# Altium project de10ext.PrjPcb
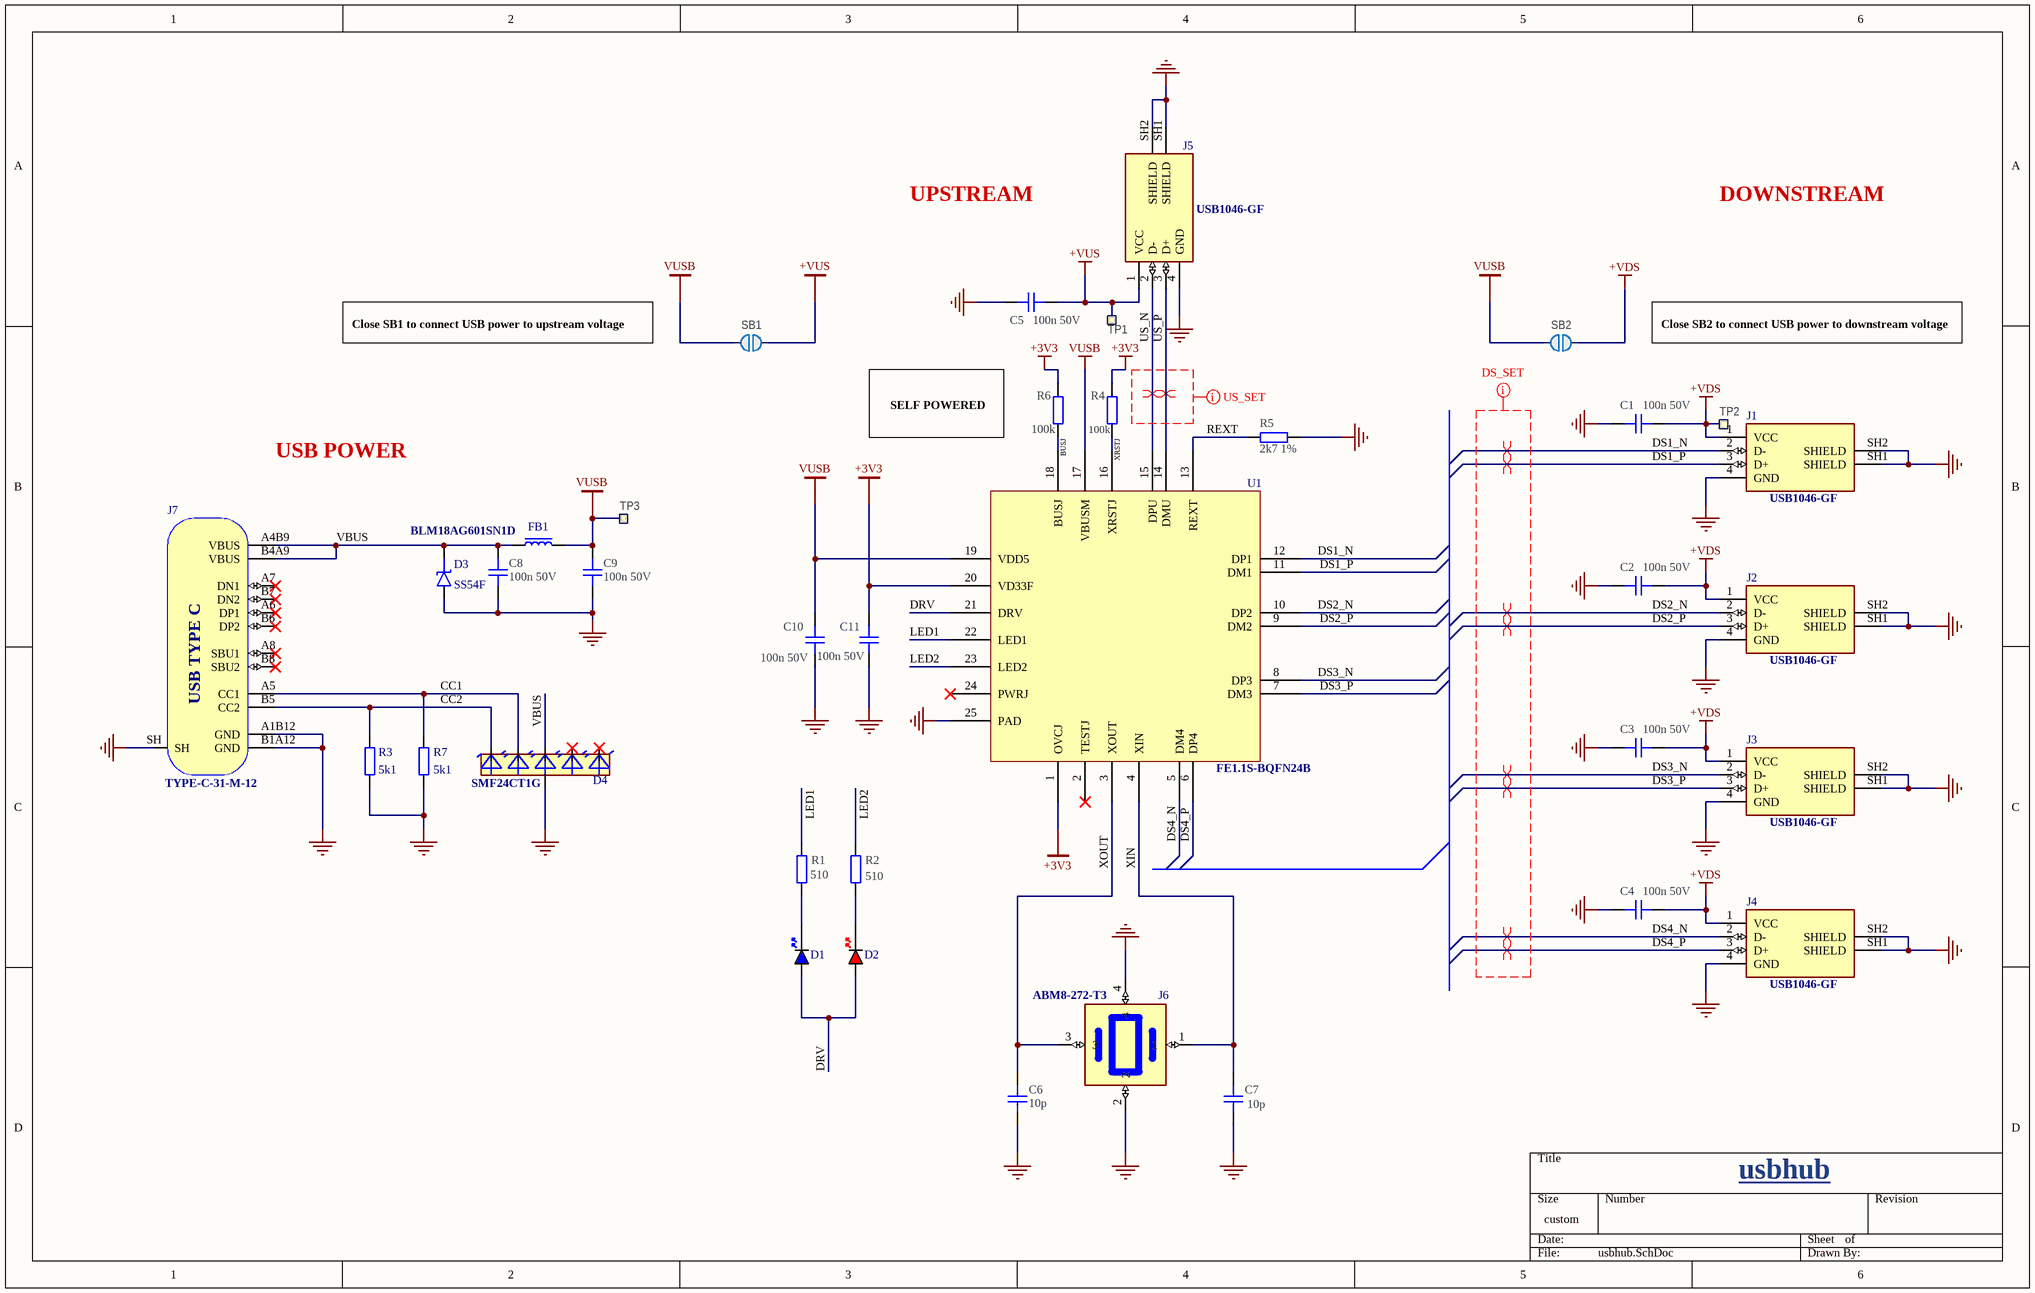
[diagram p0: usbhub.SchDoc]
2 sheets, 81 parts. Net scope: global (net labels, ports and power ports of the same name join across sheets).
Board file: de10ext.PcbDoc
Sheets:
  usbhub.SchDoc
  vga&audio.SchDoc

## Sheet usbhub.SchDoc
size 381 x 241 mm; SheetNumber: 1; SheetTotal: 2

### Parts
C1  100n 50V  [CAPC1005X04L]
C2  100n 50V  [CAPC1005X04L]
C3  100n 50V  [CAPC1005X04L]
C4  100n 50V  [CAPC1005X04L]
C5  100n 50V  [CAPC1005X04L]
C6  10p  [CAPC1005X04L]
C7  10p  [CAPC1005X04L]
C8  100n 50V  [CAPC1005X04L]
C9  100n 50V  [CAPC1005X04L]
C10  100n 50V  [CAPC1005X04L]
C11  100n 50V  [CAPC1005X04L]
D1  BLUE  [LED_0402_BLUE]  (value not drawn)
D2  RED  [LED_0402_RED]  (value not drawn)
D3  SS54F  [DIOM5226X100N]
D4  SMF24CT1G  [SOT65P210X110-6N]
FB1  BLM18AG601SN1D  [FB_0603]
J1  USB1046-GF  [GCT_USB1046-GF-0190-L-B-A_REVB4]
J2  USB1046-GF  [GCT_USB1046-GF-0190-L-B-A_REVB4]
J3  USB1046-GF  [GCT_USB1046-GF-0190-L-B-A_REVB4]
J4  USB1046-GF  [GCT_USB1046-GF-0190-L-B-A_REVB4]
J5  USB1046-GF  [GCT_USB1046-GF-0190-L-B-A_REVB4]
J6  ABM8-272-T3  [ABM8-272-T3]
J7  TYPE-C-31-M-12  [TYPE-C-31-M-12]
R1  510  [RESC1005X04L]
R2  510  [RESC1005X04L]
R3  5k1  [RES_0603]
R4  100k  [RESC1005X04L]
R5  2k7 1%  [RESC1005X04L]
R6  100k  [RESC1005X04L]
R7  5k1  [RES_0603]
SB1  Solderbridge  [Solderbridge]  (value not drawn)  (no BOM)
SB2  Solderbridge  [Solderbridge]  (value not drawn)  (no BOM)
TP1  Ø1.0mm,SMD  [TP_SMD_D1.0mm]  (value not drawn)  (no BOM)
TP2  Ø1.0mm,SMD  [TP_SMD_D1.0mm]  (value not drawn)  (no BOM)
TP3  Ø1.0mm,SMD  [TP_SMD_D1.0mm]  (value not drawn)  (no BOM)
U1  FE1.1S-BQFN24B  [QFN50P400X400X80-25N]

### Nets
+3V3: C11.2 R4.2 R6.2 U1.1(OVCJ) U1.20(VD33F)
+VDS: C1.2 C2.2 C3.2 C4.2 J1.1(VCC) J2.1(VCC) J3.1(VCC) J4.1(VCC) SB2.1 TP2.1
+VUS: C5.2 J5.1(VCC) SB1.1 TP1.1
GND: C1.1 C2.1 C3.1 C4.1 C5.1 C6.1 C7.1 C8.2 C9.2 C10.1 C11.1 D3.A D4.2(A) J1.4(GND) J1.SH1(SHIELD) J1.SH2(SHIELD) J2.4(GND) J2.SH1(SHIELD) J2.SH2(SHIELD) J3.4(GND) J3.SH1(SHIELD) J3.SH2(SHIELD) J4.4(GND) J4.SH1(SHIELD) J4.SH2(SHIELD) J5.4(GND) J5.SH1(SHIELD) J5.SH2(SHIELD) J6.2 J6.4 J7.A1B12(GND) J7.B1A12(GND) J7.SH R3.1 R5.2 R7.1 U1.25(PAD)
VUSB: C9.1 C10.2 FB1.1 SB1.2 SB2.2 TP3.1 U1.17(VBUSM) U1.19(VDD5)
BUSJ: R6.1 U1.18(BUSJ)
CC1: D4.3(C2) J7.A5(CC1) R7.2
CC2: D4.1(C1) J7.B5(CC2) R3.2
DRV: D1.A D2.A U1.21(DRV)
DS1_N: J1.2(D-) U1.12(DP1)
DS1_P: J1.3(D+) U1.11(DM1)
DS2_N: J2.2(D-) U1.10(DP2)
DS2_P: J2.3(D+) U1.9(DM2)
DS3_N: J3.2(D-) U1.8(DP3)
DS3_P: J3.3(D+) U1.7(DM3)
DS4_N: J4.2(D-) U1.5(DM4)
DS4_P: J4.3(D+) U1.6(DP4)
LED1: R1.2 U1.22(LED1)
LED2: R2.2 U1.23(LED2)
REXT: R5.1 U1.13(REXT)
US_N: J5.2(D-) U1.15(DPU)
US_P: J5.3(D+) U1.14(DMU)
VBUS: C8.1 D3.K D4.4(C3) FB1.2 J7.A4B9(VBUS) J7.B4A9(VBUS)
XIN: C7.2 J6.1 U1.4(XIN)
XOUT: C6.2 J6.3 U1.3(XOUT)
XRSTJ: R4.1 U1.16(XRSTJ)
NetD1_K: D1.K R1.1
NetD2_K: D2.K R2.1

Not connected (* = marked no-connect by the designer): D4 5(C4)* 6(C5)*; J7 A6(DP1)* A7(DN1)* A8(SBU1)* B6(DP2)* B7(DN2)* B8(SBU2)*; U1 2(TESTJ)* 24(PWRJ)*

### Layout directives
mark named DS_SET: (no net found under the mark)
differential pair: DS1_N, DS1_P, DS2_N, DS2_P, DS3_N, DS3_P, DS4_N, DS4_P, US_N, US_P
mark named US_SET: (no net found under the mark)

### Notes on the sheet
- UPSTREAM
- DOWNSTREAM
- Close SB1 to connect USB power to upstream voltage
- Close SB2 to connect USB power to downstream voltage
- SELF POWERED
- USB POWER
- usbhub
- (in symbol TYPE-C-31-M-12) USB TYPE C

### Library data of the parts
C1-C11 = C0402-4µ7: Capacitor, X5R, ±20%; Manufacturer: N.A.; Part number IPS: 00000001251, 00000007165; Part number NEMS: 100200193; Value: 4.7µF; Note: 10V; Artikkelnr Noca: 20039482; Pad Count: 2; Component Status: Active; Part Number: C0402-4µ7; Manufacturer Part Number: N.A.; ComponentLink1URL: N.A.; ComponentLink1Description: Datasheet; ComponentLink2URL: N.A.; ComponentLink2Description: Supplier link; HelpURL: N.A.; Footprint Doc: 0402; LatestRevisionDate: 2017-11-09; Published: 2009-05-08; Supplier 1: Digi-Key; Supplier Part Number 1: 490-13252-1-ND; Supplier 2: N.A.; Supplier Part Number 2: N.A.; PartId: 100200193; Component Class: Capacitors; Author: rsk; Part number Norautron: N.A.
D1 = LED_0402_BLUE: LED 0402 BLUE SMD
D2 = LED_0402_RED: LED 0402 RED SMD
D3 = Schottky Diode_3: Schottky Diode SMD SMAF package
D4 = SMF24CT1G: Quint Uni-Directional TVS Diode, 100W, 6-Pin SC-88 | ON Semiconductor SMF24CT1G; MP: SMF05C; MF: ProTek Devices; Price: None; Availability: In Stock; Package: TSSOP-6 ProTek Devices; SnapEDA_Link: https://www.snapeda.com/parts/SMF05C/Protek+Devices/view-part/?ref=snap; Check_prices: https://www.snapeda.com/parts/SMF05C/Protek+Devices/view-part/?ref=eda; Value: *
FB1 = FB_0603: Ferrite Bead SMD 0603; Manufacturer: *; Manufacturer Part Number: *; Distributor Link: *; LCSC: *
J1-J5 = USB1046-GF-0190-L-B-A_REVB4: USB-A (USB TYPE-A) USB 2.0 Receptacle Connector 4 Position Surface Mount, Through Hole; MF: Global Connector Technology; SnapEDA_Link: https://www.snapeda.com/parts/USB1046-GF-0190-L-B-A/Global+Connector+Technology/view-part/?ref=snap; Package: None; Value: *; MP: USB1046-GF-0190-L-B-A; Check_prices: https://www.snapeda.com/parts/USB1046-GF-0190-L-B-A/Global+Connector+Technology/view-part/?ref=eda
J6 = ABM8-272-T3: 12 MHz Â±30ppm Crystal 10pF 50 Ohms 4-SMD, No Lead; MF: ABRACON; SnapEDA_Link: https://www.snapeda.com/parts/ABM8-272-T3/Abracon/view-part/?ref=snap; Package: SMD-4 Abracon; Value: *; MP: ABM8-272-T3; Check_prices: https://www.snapeda.com/parts/ABM8-272-T3/Abracon/view-part/?ref=eda
J7 = TYPE-C-31-M-12: USB Type C Connector Horizontal SMT; Manufacturer: Koren Hroparts; Manufacturer Part Number: TYPE-C-31-M-12
R1 R2 R4-R6 = R0402-0R: Resistor, ±5%, 0.063W; Manufacturer: N.A.; Part number IPS: 00000007128; Part number NEMS: 100100109; Value: 0R; Note: Chip Res 5%; Artikkelnr Noca: 27049000; Pad Count: 2; Component Status: Active; Part Number: R0402-0R; Manufacturer Part Number: N.A.; ComponentLink1URL: N.A.; ComponentLink1Description: Datasheet; ComponentLink2URL: N.A.; ComponentLink2Description: Supplier link; HelpURL: N.A.; Footprint Doc: 0402; LatestRevisionDate: 2009-11-23; Published: 2009-05-08; Supplier 1: Farnell; Supplier Part Number 1: 146-9661; Supplier 2: N.A.; Supplier Part Number 2: N.A.; PartId: 100100109; Component Class: Resistors; Author: rsk; Part number Norautron: N.A.
R3 R7 = RES_0603: Resistor SMD 0603; Manufacturer: *; Manufacturer Part Number: *; Distributor Link: *; LCSC: *
SB1 SB2 = Solderbridge: Manufacturer: N.A.; Part number NEMS: 100500458; Pad Count: 2; Component Status: Active; System: Connector; Part Number: Solderbridge; Manufacturer Part Number: N.A.; LatestRevisionDate: 2009-12-14; Published: 2009-12-14; Value: Solderbridge; Note: N.A.; Artikkelnr Noca: N.A.; Footprint Doc: Solderbridge; Part number IPS: N.A.; ComponentLink1URL: N.A.; ComponentLink1Description: Datasheet; ComponentLink2URL: N.A.; ComponentLink2Description: Supplier link; HelpURL: N.A.; Supplier 1: N.A.; Supplier Part Number 1: N.A.; Supplier 2: N.A.; Supplier Part Number 2: N.A.; PartId: 100500458; Component Class: Connectors; Author: rsk; Part number Norautron: N.A.
TP1-TP3 = TP_SMD_Ø1.0MM: 1.0mm circular SMD testpad; Manufacturer: Nordic Semiconductor; Manufacturer Part Number: N.A.; Part number NEMS: 100500475; Pad Count: 1; Component Status: Active; Part Number: TP_SMD_Ø1.0MM; ComponentLink1URL: N.A.; ComponentLink1Description: Datasheet; ComponentLink2URL: N.A.; ComponentLink2Description: Supplier link; HelpURL: N.A.; Footprint Doc: TP_SMD_Ø1.0mm; LatestRevisionDate: 2021-03-05; Published: 2013-06-11; Value: Ø1.0mm,SMD; Note: N.A.; Artikkelnr Noca: N.A.; Part number IPS: N.A.; Supplier 1: N.A.; Supplier Part Number 1: N.A.; Supplier 2: N.A.; Supplier Part Number 2: N.A.; PartId: 100500475; Component Class: Connectors; Author: rsk; Part number Norautron: N.A.
U1 = FE1.1S-BQFN24B: USB Hub USB 2.0 WQFN-24 Interface Controllers RoHS

## Sheet vga&audio.SchDoc
size 431 x 228 mm; SheetNumber: 2; SheetTotal: 2
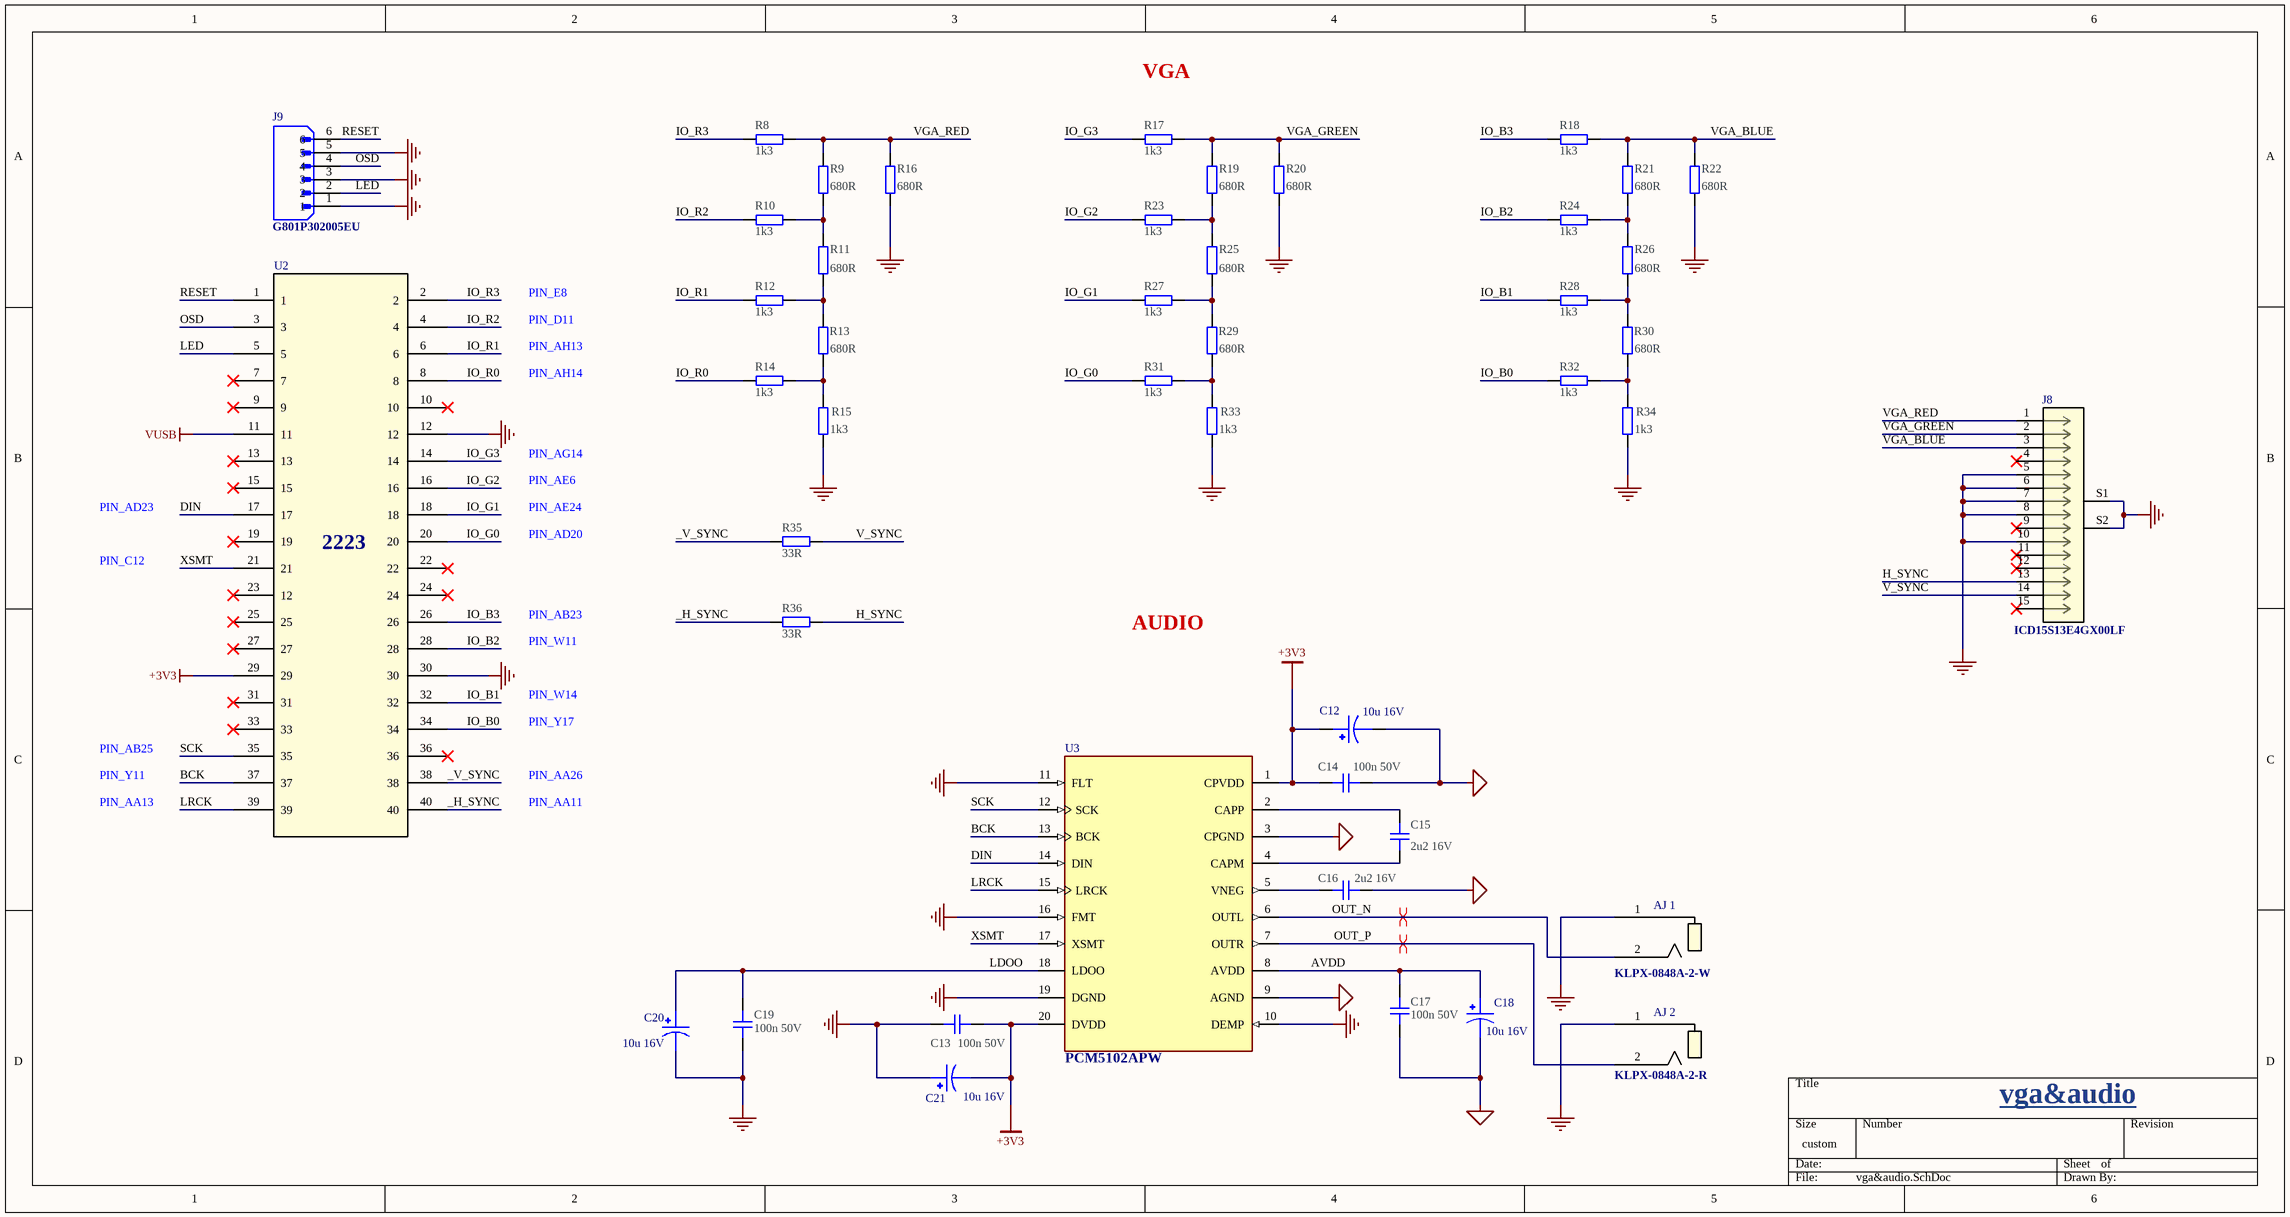
[diagram p1: vga&audio.SchDoc]

### Parts
AJ_1  KLPX-0848A-2-W  [KLPX0848A2W]
AJ_2  KLPX-0848A-2-R  [KLPX0848A2R]
C12  10u 16V  [CAPMP3216X180N]
C13  100n 50V  [CAPC1005X04L]
C14  100n 50V  [CAPC1005X04L]
C15  2u2 16V  [CAPC1005X04L]
C16  2u2 16V  [CAPC1005X04L]
C17  100n 50V  [CAPC1005X04L]
C18  10u 16V  [CAPMP3216X180N]
C19  100n 50V  [CAPC1005X04L]
C20  10u 16V  [CAPMP3216X180N]
C21  10u 16V  [CAPMP3216X180N]
J8  ICD15S13E4GX00LF  [AMPHENOL_ICD15S13E4GX00LF]
J9  G801P302005EU  [AMPHENOL_G801P302005EU]
R8  1k3  [RESC1005X04L]
R9  680R  [RESC1005X04L]
R10  1k3  [RESC1005X04L]
R11  680R  [RESC1005X04L]
R12  1k3  [RESC1005X04L]
R13  680R  [RESC1005X04L]
R14  1k3  [RESC1005X04L]
R15  1k3  [RESC1005X04L]
R16  680R  [RESC1005X04L]
R17  1k3  [RESC1005X04L]
R18  1k3  [RESC1005X04L]
R19  680R  [RESC1005X04L]
R20  680R  [RESC1005X04L]
R21  680R  [RESC1005X04L]
R22  680R  [RESC1005X04L]
R23  1k3  [RESC1005X04L]
R24  1k3  [RESC1005X04L]
R25  680R  [RESC1005X04L]
R26  680R  [RESC1005X04L]
R27  1k3  [RESC1005X04L]
R28  1k3  [RESC1005X04L]
R29  680R  [RESC1005X04L]
R30  680R  [RESC1005X04L]
R31  1k3  [RESC1005X04L]
R32  1k3  [RESC1005X04L]
R33  1k3  [RESC1005X04L]
R34  1k3  [RESC1005X04L]
R35  33R  [RESC1005X04L]
R36  33R  [RESC1005X04L]
U2  2223  [2223_ADA]
U3  PCM5102APW  [SOP65P640X120-20N]

### Nets
+3V3: C12.1 C13.1 C14.2 C21.2 U2.29 U3.1(CPVDD) U3.20(DVDD)
AGND: C12.2 C14.1 C16.2 C17.2 C18.2 U3.3(CPGND) U3.9(AGND)
GND: AJ_1.1 AJ_2.1 C13.2 C19.2 C20.2 C21.1 J8.5 J8.6 J8.7 J8.8 J8.10 J8.S1(SHIELD) J8.S2(SHIELD) J9.1 J9.3 J9.5 R15.2 R16.1 R20.1 R22.1 R33.2 R34.2 U2.12 U2.30 U3.10(DEMP) U3.11(FLT) U3.16(FMT) U3.19(DGND)
VUSB: U2.11
_H_SYNC: R36.1 U2.40
_V_SYNC: R35.1 U2.38
AVDD: C17.1 C18.1 U3.8(AVDD)
BCK: U2.37 U3.13(BCK)
DIN: U2.17 U3.14(DIN)
H_SYNC: J8.13 R36.2
IO_B0: R32.1 U2.34
IO_B1: R28.1 U2.32
IO_B2: R24.1 U2.28
IO_B3: R18.1 U2.26
IO_G0: R31.1 U2.20
IO_G1: R27.1 U2.18
IO_G2: R23.1 U2.16
IO_G3: R17.1 U2.14
IO_R0: R14.1 U2.8
IO_R1: R12.1 U2.6
IO_R2: R10.1 U2.4
IO_R3: R8.1 U2.2
LDOO: C19.1 C20.1 U3.18(LDOO)
LED: J9.2 U2.5
LRCK: U2.39 U3.15(LRCK)
OSD: J9.4 U2.3
OUT_N: AJ_1.2 U3.6(OUTL)
OUT_P: AJ_2.2 U3.7(OUTR)
RESET: J9.6 U2.1
SCK: U2.35 U3.12(SCK)
V_SYNC: J8.14 R35.2
VGA_BLUE: J8.3 R18.2 R21.2 R22.2
VGA_GREEN: J8.2 R17.2 R19.2 R20.2
VGA_RED: J8.1 R8.2 R9.2 R16.2
XSMT: U2.21 U3.17(XSMT)
NetC15_1: C15.1 U3.2(CAPP)
NetC15_2: C15.2 U3.4(CAPM)
NetC16_1: C16.1 U3.5(VNEG)
NetR9_1: R9.1 R10.2 R11.2
NetR11_1: R11.1 R12.2 R13.2
NetR13_1: R13.1 R14.2 R15.1
NetR19_1: R19.1 R23.2 R25.2
NetR21_1: R21.1 R24.2 R26.2
NetR25_1: R25.1 R27.2 R29.2
NetR26_1: R26.1 R28.2 R30.2
NetR29_1: R29.1 R31.2 R33.1
NetR30_1: R30.1 R32.2 R34.1

Not connected (* = marked no-connect by the designer): J8 4* 9* 11* 12* 15*; U2 7* 9* 10* 13* 15* 19* 22* 23(12)* 24* 25* 27* 31* 33* 36*

### Layout directives
differential pair: OUT_N, OUT_P

### Notes on the sheet
- VGA
- PIN_E8
- PIN_D11
- PIN_AH13
- PIN_AH14
- PIN_AG14
- PIN_AE6
- PIN_C12
- PIN_AD23
- PIN_AE24
- PIN_AD20
- PIN_AB23
- AUDIO
- PIN_W11
- PIN_W14
- PIN_AB25
- PIN_Y17
- PIN_AA13
- PIN_Y11
- PIN_AA26
- PIN_AA11
- vga&audio

### Library data of the parts
AJ_1 = KLPX-0848A-2-W: Description; Manufacturer_Name: KYCON, INC.; Manufacturer_Part_Number: KLPX-0848A-2-R; Copyright: Copyright (C) 2025 Ultra Librarian. All rights reserved.; RefDes: RefDes; Type: Type
AJ_2 = KLPX-0848A-2-R: Description; Manufacturer_Name: KYCON, INC.; Copyright: Copyright (C) 2025 Ultra Librarian. All rights reserved.; Manufacturer_Part_Number: KLPX-0848A-2-R; RefDes: RefDes; Type: Type
C12 C18 C20 C21 = TAJA106K016RNJ: 10 ÂµF Molded Tantalum Capacitors 16 V 1206 (3216 Metric) 3Ohm; MF: KYOCERA AVX; SnapEDA_Link: https://www.snapeda.com/parts/TAJA106K016RNJ/Kyocera/view-part/?ref=snap; Package: Package; Value: *; MP: TAJA106K016RNJ; Check_prices: https://www.snapeda.com/parts/TAJA106K016RNJ/Kyocera/view-part/?ref=eda
C13-C17 C19 = C0402-4µ7: as C1 on sheet usbhub; Part Number: C0402-4µ7; Manufacturer Part Number: N.A.; ComponentLink1URL: N.A.; ComponentLink1Description: Datasheet; ComponentLink2URL: N.A.; ComponentLink2Description: Supplier link; HelpURL: N.A.; Footprint Doc: 0402; LatestRevisionDate: 2017-11-09; Published: 2009-05-08; Supplier 1: Digi-Key; Supplier Part Number 1: 490-13252-1-ND; Supplier 2: N.A.; Supplier Part Number 2: N.A.; PartId: 100200193; Component Class: Capacitors; Author: rsk; Part number Norautron: N.A.
J8 = ICD15S13E4GX00LF: Conn High Density D-Sub SKT 15 POS 2.28mm Solder RA Thru-Hole 15 Terminal 1 Port; MF: Amphenol; Package: None; Price: None; Check_prices: https://www.snapeda.com/parts/ICD15S13E4GX00LF/LC/view-part/?ref=eda; Value: *; SnapEDA_Link: https://www.snapeda.com/parts/ICD15S13E4GX00LF/LC/view-part/?ref=snap; MP: ICD15S13E4GX00LF; Availability: In Stock; Purchase-URL: https://pricing.snapeda.com/search?q=ICD15S13E4GX00LF&ref=eda
J9 = G801P302005EU: MF: {'manufacturer': u'Amphenol ICC (Commercial Products)'}; Package: None; Price: None; Value: *; MP: G801P302005EU; Availability: Unavailable
R8-R36 = R0402-0R: as R1 on sheet usbhub; Part Number: R0402-0R; Manufacturer Part Number: N.A.; ComponentLink1URL: N.A.; ComponentLink1Description: Datasheet; ComponentLink2URL: N.A.; ComponentLink2Description: Supplier link; HelpURL: N.A.; Footprint Doc: 0402; LatestRevisionDate: 2009-11-23; Published: 2009-05-08; Supplier 1: Farnell; Supplier Part Number 1: 146-9661; Supplier 2: N.A.; Supplier Part Number 2: N.A.; PartId: 100100109; Component Class: Resistors; Author: rsk; Part number Norautron: N.A.
U2 = 2223: Description; Manufacturer_Name: Adafruit Industries; Copyright: Copyright (C) 2025 Ultra Librarian. All rights reserved.; Manufacturer_Part_Number: 2223; RefDes: RefDes; Type: Type
U3 = PCM5102APW: 2VRMS DirectPathâ„¢, DAC estÃ©reo de Ã¡udio de 112dB com interface PCM de 32 bits e 384kHz 20-TSSOP -25 a 85; MF: Texas Instruments; Purchase-URL: https://pricing.snapeda.com/search/part/PCM5102APW/?ref=eda; MP: PCM5102APW; Value: *; Availability: In Stock; Check_prices: https://www.snapeda.com/parts/PCM5102APW/Texas+Instruments/view-part/?ref=eda; SnapEDA_Link: https://www.snapeda.com/parts/PCM5102APW/Texas+Instruments/view-part/?ref=snap; Price: None; Package: TSSOP-20 Texas Instruments

## Nets that join several sheets
+3V3: usbhub (5 pins), vga&audio (7 pins)
GND: usbhub (37 pins), vga&audio (28 pins)
VUSB: usbhub (8 pins), vga&audio (U2.11)